# Altium schematic sheet IR_Sensor.SchDoc
size Legal; SheetNumber: 1; SheetTotal: 4
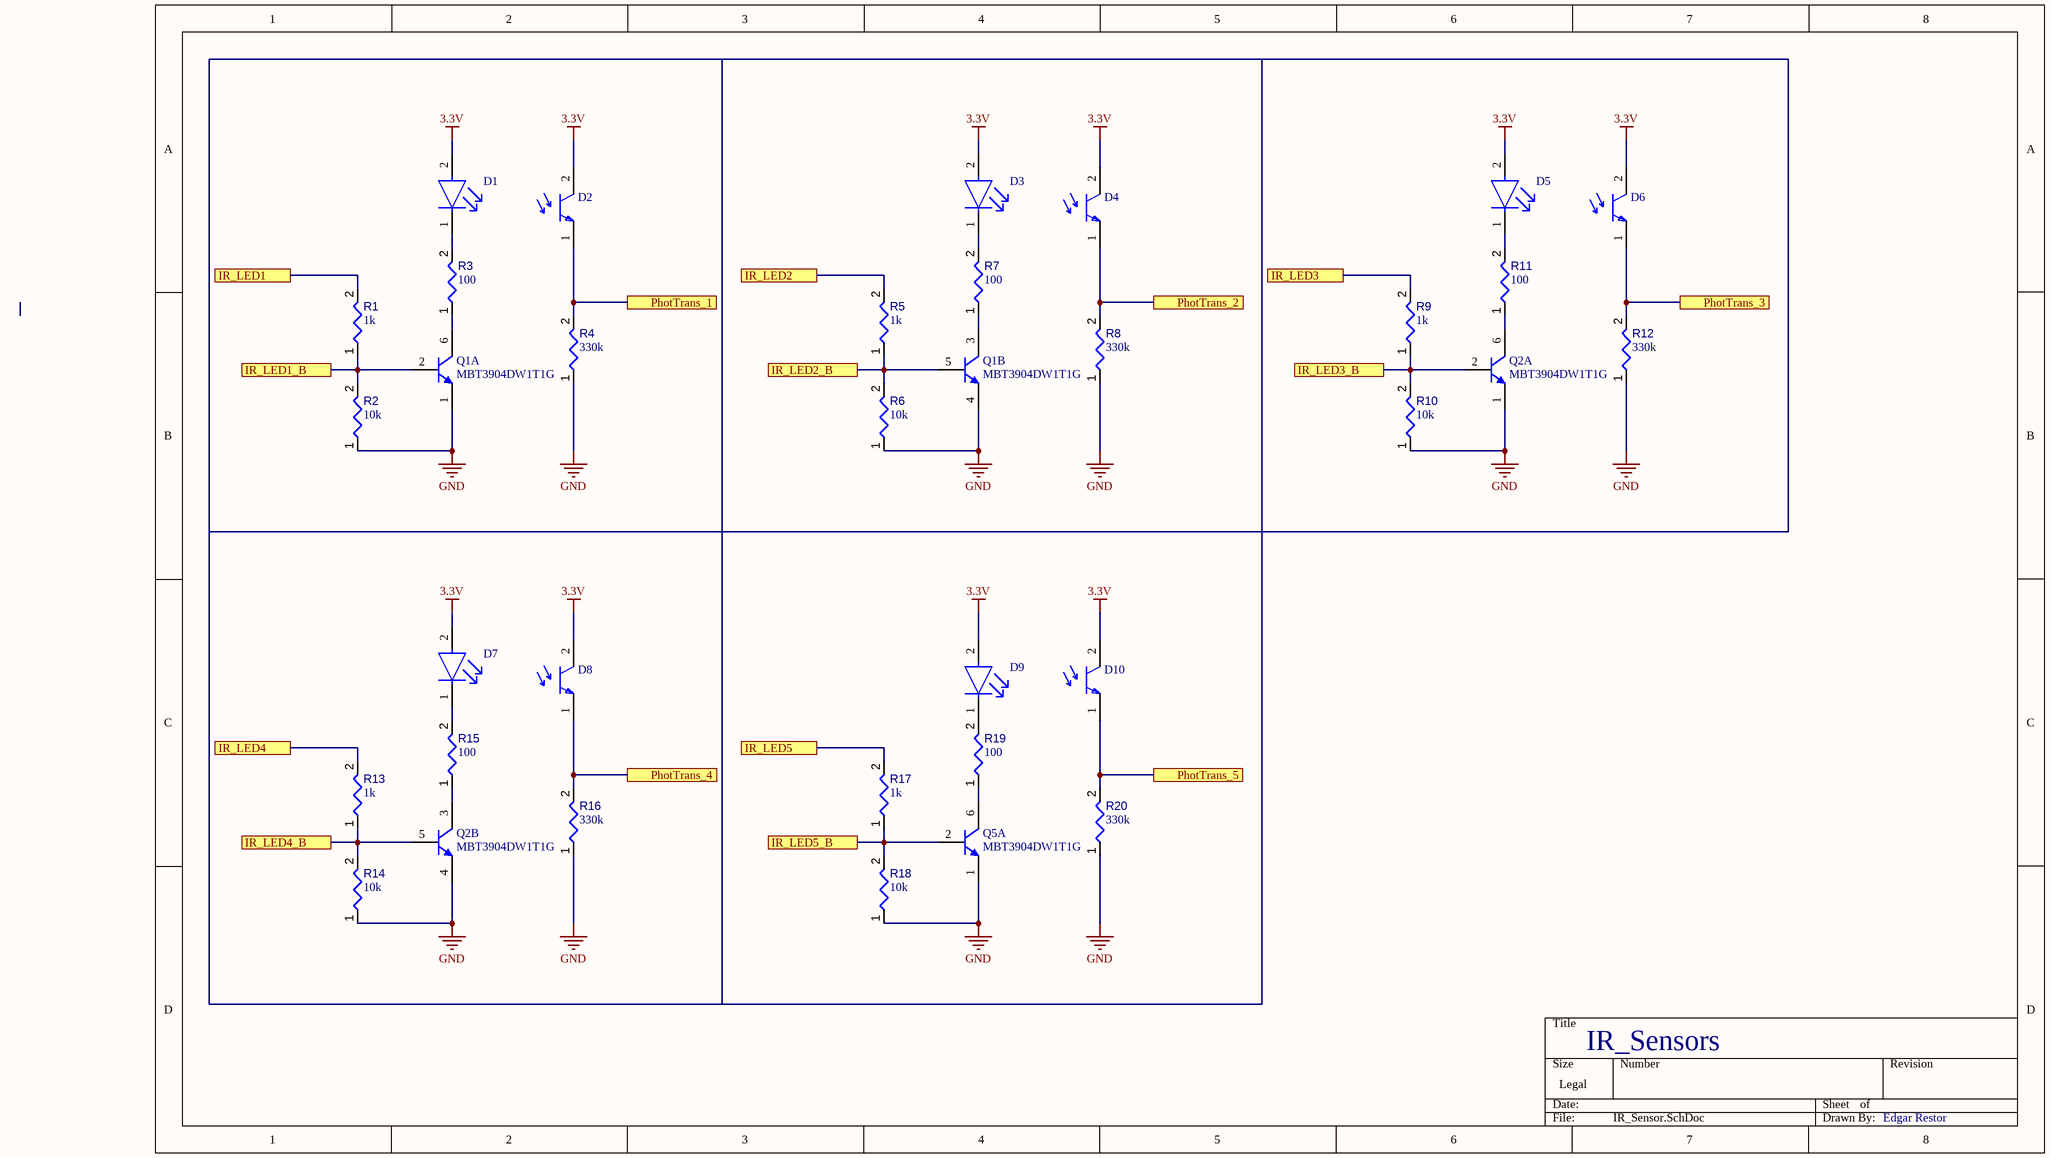
[diagram p0: IR_Sensor.SchDoc]

## Parts
D1  (no value)  [FP-551-0207F-MFG]
D2  TEFT4300  [FP-6_544-5269_01-4-MFG]  (value not drawn)
D3  (no value)  [FP-551-0207F-MFG]
D4  TEFT4300  [FP-6_544-5269_01-4-MFG]  (value not drawn)
D5  (no value)  [FP-551-0207F-MFG]
D6  TEFT4300  [FP-6_544-5269_01-4-MFG]  (value not drawn)
D7  (no value)  [FP-551-0207F-MFG]
D8  TEFT4300  [FP-6_544-5269_01-4-MFG]  (value not drawn)
D9  (no value)  [FP-551-0207F-MFG]
D10  TEFT4300  [FP-6_544-5269_01-4-MFG]  (value not drawn)
Q1  MBT3904DW1T1G  [ONSC-SOT-363-6-419B-02_W_V]  (parts A,B of 2)
Q2  MBT3904DW1T1G  [ONSC-SOT-363-6-419B-02_W_V]  (parts A,B of 2)
Q5  MBT3904DW1T1G  [ONSC-SOT-363-6-419B-02_W_V]  (part A of 2)
R1  value 1k  [RESC0402(1005)_L]  (hidden comment: Resistor 4K02 +/-1 % 0402 63 mW)
R2  value 10k  [RESC0402(1005)_L]  (hidden comment: Resistor 4K02 +/-1 % 0402 63 mW)
R3  value 100  [RESC0402(1005)_L]  (hidden comment: Resistor 4K02 +/-1 % 0402 63 mW)
R4  value 330k  [RESC0402(1005)_L]  (hidden comment: Resistor 4K02 +/-1 % 0402 63 mW)
R5  value 1k  [RESC0402(1005)_L]  (hidden comment: Resistor 4K02 +/-1 % 0402 63 mW)
R6  value 10k  [RESC0402(1005)_L]  (hidden comment: Resistor 4K02 +/-1 % 0402 63 mW)
R7  value 100  [RESC0402(1005)_L]  (hidden comment: Resistor 4K02 +/-1 % 0402 63 mW)
R8  value 330k  [RESC0402(1005)_L]  (hidden comment: Resistor 4K02 +/-1 % 0402 63 mW)
R9  value 1k  [RESC0402(1005)_L]  (hidden comment: Resistor 4K02 +/-1 % 0402 63 mW)
R10  value 10k  [RESC0402(1005)_L]  (hidden comment: Resistor 4K02 +/-1 % 0402 63 mW)
R11  value 100  [RESC0402(1005)_L]  (hidden comment: Resistor 4K02 +/-1 % 0402 63 mW)
R12  value 330k  [RESC0402(1005)_L]  (hidden comment: Resistor 4K02 +/-1 % 0402 63 mW)
R13  value 1k  [RESC0402(1005)_L]  (hidden comment: Resistor 4K02 +/-1 % 0402 63 mW)
R14  value 10k  [RESC0402(1005)_L]  (hidden comment: Resistor 4K02 +/-1 % 0402 63 mW)
R15  value 100  [RESC0402(1005)_L]  (hidden comment: Resistor 4K02 +/-1 % 0402 63 mW)
R16  value 330k  [RESC0402(1005)_L]  (hidden comment: Resistor 4K02 +/-1 % 0402 63 mW)
R17  value 1k  [RESC0402(1005)_L]  (hidden comment: Resistor 4K02 +/-1 % 0402 63 mW)
R18  value 10k  [RESC0402(1005)_L]  (hidden comment: Resistor 4K02 +/-1 % 0402 63 mW)
R19  value 100  [RESC0402(1005)_L]  (hidden comment: Resistor 4K02 +/-1 % 0402 63 mW)
R20  value 330k  [RESC0402(1005)_L]  (hidden comment: Resistor 4K02 +/-1 % 0402 63 mW)

## Ports
IR_LED1, IR_LED1_B, IR_LED2, IR_LED2_B, IR_LED3, IR_LED3_B, IR_LED4, IR_LED4_B, IR_LED5, IR_LED5_B, PhotTrans_1, PhotTrans_2, PhotTrans_3, PhotTrans_4, PhotTrans_5

## Nets
3.3V: D1.2(A) D2.2(C) D3.2(A) D4.2(C) D5.2(A) D6.2(C) D7.2(A) D8.2(C) D9.2(A) D10.2(C)
GND: Q1.1(E) Q1.4(E) Q2.1(E) Q2.4(E) Q5.1(E) R2.1 R4.1 R6.1 R8.1 R10.1 R12.1 R14.1 R16.1 R18.1 R20.1
IR_LED1: R1.2 ; port IR_LED1
IR_LED1_B: Q1.2(B) R1.1 R2.2 ; port IR_LED1_B
IR_LED2: R5.2 ; port IR_LED2
IR_LED2_B: Q1.5(B) R5.1 R6.2 ; port IR_LED2_B
IR_LED3: R9.2 ; port IR_LED3
IR_LED3_B: Q2.2(B) R9.1 R10.2 ; port IR_LED3_B
IR_LED4: R13.2 ; port IR_LED4
IR_LED4_B: Q2.5(B) R13.1 R14.2 ; port IR_LED4_B
IR_LED5: R17.2 ; port IR_LED5
IR_LED5_B: Q5.2(B) R17.1 R18.2 ; port IR_LED5_B
PhotTrans_1: D2.1(E) R4.2 ; port PhotTrans_1
PhotTrans_2: D4.1(E) R8.2 ; port PhotTrans_2
PhotTrans_3: D6.1(E) R12.2 ; port PhotTrans_3
PhotTrans_4: D8.1(E) R16.2 ; port PhotTrans_4
PhotTrans_5: D10.1(E) R20.2 ; port PhotTrans_5
NetD1_1: D1.1(C) R3.2
NetD3_1: D3.1(C) R7.2
NetD5_1: D5.1(C) R11.2
NetD7_1: D7.1(C) R15.2
NetD9_1: D9.1(C) R19.2
NetQ1_3: Q1.3(C) R7.1
NetQ1_6: Q1.6(C) R3.1
NetQ2_3: Q2.3(C) R15.1
NetQ2_6: Q2.6(C) R11.1
NetQ5_6: Q5.6(C) R19.1

## Notes on the sheet
- IR_Sensors
- Edgar Restor

## Library data of the parts
D1 D3 D5 D7 D9 = CMP-15384-000011-1: LED 3MM HIGH EFF GREEN; Viewing Angle: 45°; Lens Size: 5mm; Dominant Wavelength: 563nm; Test Current: 10mA; Power Dissipation: 75mW; Luminous Intensity: 16mcd; Operating Supply Voltage: 2.1V; Reverse Voltage: 3V; Number of LEDs: 1; Lens Style: Diffused; Element Configuration: Single; Mount: Through Hole; Series: 551; Lead Free: Lead Free; Number of Pins: 2; Width: 4.32mm; Packaging: Bulk; Color: Green; REACH SVHC: No SVHC; Lens Color: Green; Package Quantity: 100; Min Operating Temperature: -25°C; Forward Current: 10mA; Height: 7.11mm; RoHS Compliant: Yes; Illumination Color: Green; Number of Elements: 1; Voltage Rating: 2.1V; Radiation Hardening: No; Length: 4.32mm; Depth: 8.89mm; Forward Voltage: 2.1V; Current: 10mA; Wavelength: 563nm; Orientation: Right Angle; Max Operating Temperature: 85°C
D2 D4 D6 D8 D10 = CMP-00030-39729854-1: TEFT4300 PHOTOTRANSISTOR 3.0MM WIDE VIEW / Phototransistor IR Chip Silicon 925nm 2-Pin T-1; Polarity: NPN; Lens Style: Domed; Max Power Dissipation: 100mW; Viewing Angle: 30°; Collector Emitter Breakdown Voltage: 70V; Number of Elements: 1; Rise Time: 2µs; Dark Current: 200nA; Collector Emitter Saturation Voltage: 300mV; Fall Time: 2.3µs; Max Collector Current: 50mA; Max Operating Temperature: 100°C; Schedule B: 8541407080, 8541407080; Min Operating Temperature: -40°C; Orientation: Top View; Height: 4.5mm; Radiation Hardening: No; Power Consumption: 100mW; RoHS: Compliant; Case/Package: T; Lead Free: Lead Free; REACH SVHC: Unknown; NexarPartId: 39729854; Mount: Through Hole; Wavelength: 925nm; Power Dissipation: 100mW; Number of Channels: 1; Number of Pins: 2; Collector Emitter Voltage (VCEO): 70V; Width: 3.9mm; Length: 3.2mm
Q1 Q2 Q5 = CMP-1048-00877-1: Dual General Purpose Transistors, 6-Pin SOT-363, Pb-Free, Tape and Reel; Manufacturer: On Semiconductor; Polarity: Dual NPN; fT Min (MHz): 300; IC Continuous (A): 0.2; DatasheetVersion: Rev. 9; ComponentLink2Description: Datasheet; Mounting Technology: Surface Mount; PackageReference: SOT-363-6-419B-02_W; RoHS: TRUE; ComponentLink1Description: Manufacturer URL; ComponentLink2URL: http://www.onsemi.com/pub_link/Collateral/MBT3904DW1T1-D.PDF; PackageVersion: Rev. W, 01/2006; Packing: Tape and Reel; PartNumber: MBT3904DW1T1G; ComponentLink1URL: http://www.onsemi.com/; ComponentLink3URL: http://www.onsemi.com/pub_link/Collateral/NTJD4001N-D.PDF; ComponentLink3Description: Package Specification; PackageDescription: 6-Pin Small Outline Transistor, Body 2 x 1.25 mm, Pitch 0.65 mm
R1-R20 = CMP-009-00153-3: Chip Resistor, 4,02 kOhms, +/-1 %, 63 mW, -55 to 155 degC, 0402; Power: 63mW; Tolerance: 1%; Min Operating Temperature: -55°C; Pins: 2; Case/Package: 0402; Max Operating Temperature: 155°C